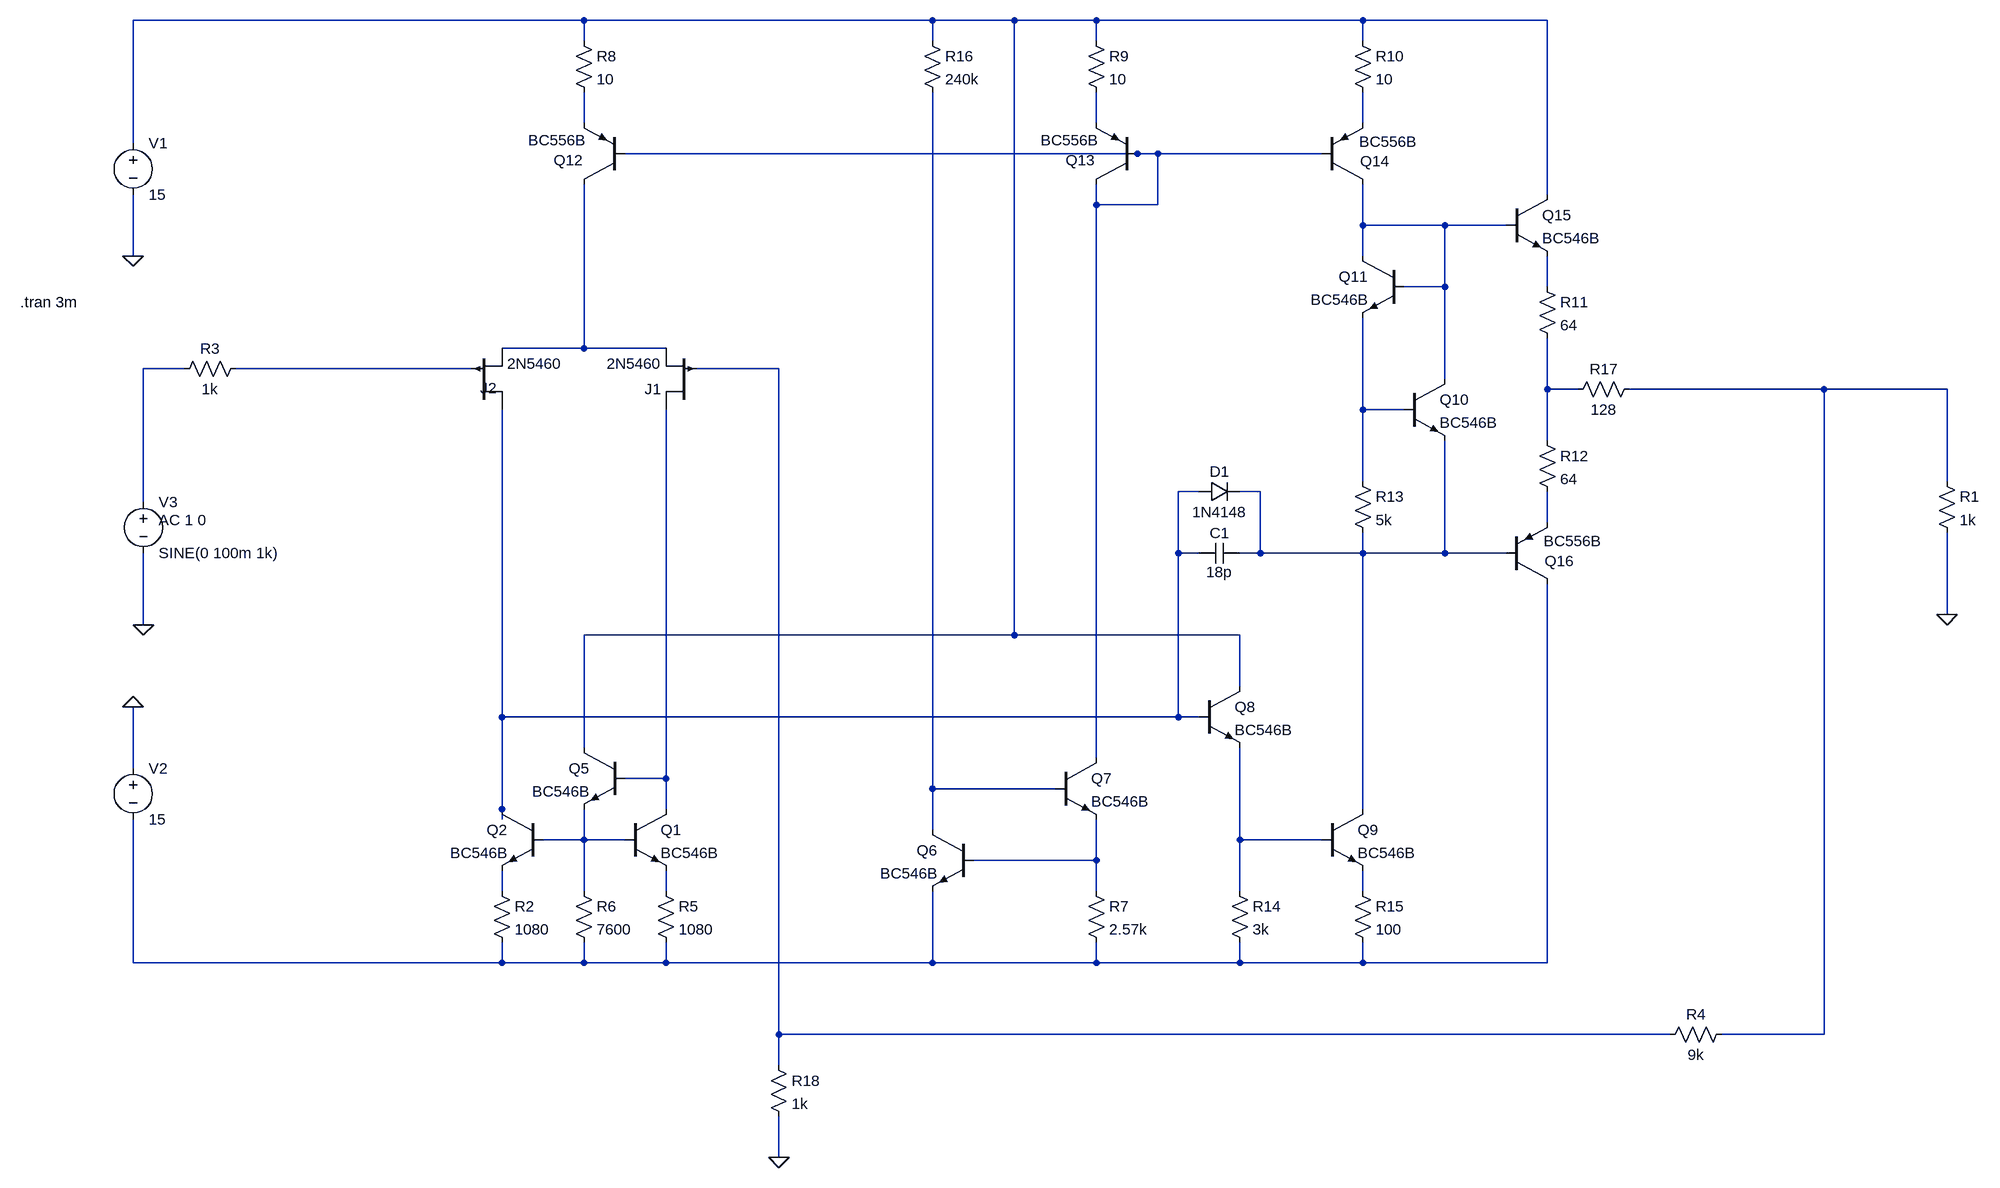
[diagram p0: schematic TL071 discrete test alone.asc]
TL071 discrete test alone.asc, the LTspice schematic file:
Version 4
SHEET 1 880 680
WIRE -9392 -4048 -10096 -4048
WIRE -8848 -4048 -9392 -4048
WIRE -8720 -4048 -8848 -4048
WIRE -8592 -4048 -8720 -4048
WIRE -8176 -4048 -8592 -4048
WIRE -7888 -4048 -8176 -4048
WIRE -9392 -4016 -9392 -4048
WIRE -8848 -4016 -8848 -4048
WIRE -8592 -4016 -8592 -4048
WIRE -8176 -4016 -8176 -4048
WIRE -9392 -3888 -9392 -3936
WIRE -8592 -3888 -8592 -3936
WIRE -8176 -3888 -8176 -3936
WIRE -10096 -3856 -10096 -4048
WIRE -8528 -3840 -9328 -3840
WIRE -8496 -3840 -8528 -3840
WIRE -8240 -3840 -8496 -3840
WIRE -7888 -3776 -7888 -4048
WIRE -8592 -3760 -8592 -3792
WIRE -8496 -3760 -8496 -3840
WIRE -8496 -3760 -8592 -3760
WIRE -8176 -3728 -8176 -3792
WIRE -8048 -3728 -8176 -3728
WIRE -7952 -3728 -8048 -3728
WIRE -10096 -3680 -10096 -3776
WIRE -8176 -3680 -8176 -3728
WIRE -8048 -3632 -8048 -3728
WIRE -8048 -3632 -8112 -3632
WIRE -7888 -3632 -7888 -3680
WIRE -9392 -3536 -9392 -3792
WIRE -9392 -3536 -9520 -3536
WIRE -9264 -3536 -9392 -3536
WIRE -10016 -3504 -10080 -3504
WIRE -9568 -3504 -9936 -3504
WIRE -9088 -3504 -9216 -3504
WIRE -8048 -3488 -8048 -3632
WIRE -7888 -3472 -7888 -3552
WIRE -7840 -3472 -7888 -3472
WIRE -7456 -3472 -7760 -3472
WIRE -7264 -3472 -7456 -3472
WIRE -8176 -3440 -8176 -3584
WIRE -8112 -3440 -8176 -3440
WIRE -7888 -3392 -7888 -3472
WIRE -8176 -3328 -8176 -3440
WIRE -7264 -3328 -7264 -3472
WIRE -8432 -3312 -8464 -3312
WIRE -8336 -3312 -8368 -3312
WIRE -10080 -3296 -10080 -3504
WIRE -7888 -3264 -7888 -3312
WIRE -8464 -3216 -8464 -3312
WIRE -8432 -3216 -8464 -3216
WIRE -8336 -3216 -8336 -3312
WIRE -8336 -3216 -8368 -3216
WIRE -8176 -3216 -8176 -3248
WIRE -8176 -3216 -8336 -3216
WIRE -8048 -3216 -8048 -3392
WIRE -8048 -3216 -8176 -3216
WIRE -7952 -3216 -8048 -3216
WIRE -7264 -3120 -7264 -3248
WIRE -10080 -3104 -10080 -3216
WIRE -8720 -3088 -8720 -4048
WIRE -8720 -3088 -9392 -3088
WIRE -8368 -3088 -8720 -3088
WIRE -8368 -3008 -8368 -3088
WIRE -9520 -2960 -9520 -3440
WIRE -8464 -2960 -8464 -3216
WIRE -8464 -2960 -9520 -2960
WIRE -8432 -2960 -8464 -2960
WIRE -9392 -2912 -9392 -3088
WIRE -8592 -2896 -8592 -3760
WIRE -10096 -2880 -10096 -2976
WIRE -9264 -2864 -9264 -3440
WIRE -9264 -2864 -9328 -2864
WIRE -8848 -2848 -8848 -3936
WIRE -8656 -2848 -8848 -2848
WIRE -9520 -2816 -9520 -2960
WIRE -9264 -2816 -9264 -2864
WIRE -8176 -2816 -8176 -3216
WIRE -9520 -2800 -9520 -2816
WIRE -8848 -2784 -8848 -2848
WIRE -9392 -2768 -9392 -2816
WIRE -9392 -2768 -9456 -2768
WIRE -9328 -2768 -9392 -2768
WIRE -8368 -2768 -8368 -2912
WIRE -8240 -2768 -8368 -2768
WIRE -8592 -2736 -8592 -2800
WIRE -8592 -2736 -8784 -2736
WIRE -9520 -2688 -9520 -2720
WIRE -9392 -2688 -9392 -2768
WIRE -9264 -2688 -9264 -2720
WIRE -8592 -2688 -8592 -2736
WIRE -8368 -2688 -8368 -2768
WIRE -8176 -2688 -8176 -2720
WIRE -10096 -2576 -10096 -2800
WIRE -9520 -2576 -9520 -2608
WIRE -9520 -2576 -10096 -2576
WIRE -9392 -2576 -9392 -2608
WIRE -9392 -2576 -9520 -2576
WIRE -9264 -2576 -9264 -2608
WIRE -9264 -2576 -9392 -2576
WIRE -8848 -2576 -8848 -2688
WIRE -8848 -2576 -9264 -2576
WIRE -8592 -2576 -8592 -2608
WIRE -8592 -2576 -8848 -2576
WIRE -8368 -2576 -8368 -2608
WIRE -8368 -2576 -8592 -2576
WIRE -8176 -2576 -8176 -2608
WIRE -8176 -2576 -8368 -2576
WIRE -7888 -2576 -7888 -3168
WIRE -7888 -2576 -8176 -2576
WIRE -9088 -2464 -9088 -3504
WIRE -7696 -2464 -9088 -2464
WIRE -7456 -2464 -7456 -3472
WIRE -7456 -2464 -7616 -2464
WIRE -9088 -2416 -9088 -2464
WIRE -9088 -2272 -9088 -2336
FLAG -10096 -3680 0
FLAG -10096 -2976 0
FLAG -10080 -3104 0
FLAG -7264 -3120 0
FLAG -9088 -2272 0
SYMBOL cap -8368 -3232 R90
WINDOW 0 0 32 VBottom 0
WINDOW 3 30 32 VTop 0
SYMATTR InstName C1
SYMATTR Value 18p
SYMBOL npn -9328 -2816 R0
SYMATTR InstName Q1
SYMATTR Value BC546B
SYMBOL npn -9456 -2816 M0
SYMATTR InstName Q2
SYMATTR Value BC546B
SYMBOL diode -8432 -3296 R270
WINDOW 0 32 32 VTop 0
WINDOW 3 0 32 VBottom 0
SYMATTR InstName D1
SYMATTR Value 1N4148
SYMBOL pjf -9216 -3440 R180
SYMATTR InstName J1
SYMATTR Value 2N5460
SYMBOL pjf -9568 -3440 M180
WINDOW 0 14 34 Left 0
SYMATTR InstName J2
SYMATTR Value 2N5460
SYMBOL npn -9328 -2912 M0
SYMATTR InstName Q5
SYMATTR Value BC546B
SYMBOL npn -8784 -2784 M0
SYMATTR InstName Q6
SYMATTR Value BC546B
SYMBOL npn -8656 -2896 R0
SYMATTR InstName Q7
SYMATTR Value BC546B
SYMBOL npn -8432 -3008 R0
SYMATTR InstName Q8
SYMATTR Value BC546B
SYMBOL npn -8240 -2816 R0
SYMATTR InstName Q9
SYMATTR Value BC546B
SYMBOL npn -8112 -3488 R0
SYMATTR InstName Q10
SYMATTR Value BC546B
SYMBOL npn -8112 -3680 M0
SYMATTR InstName Q11
SYMATTR Value BC546B
SYMBOL pnp -9328 -3792 R180
WINDOW 0 66 38 Left 0
WINDOW 3 62 69 Left 0
SYMATTR InstName Q12
SYMATTR Value BC556B
SYMBOL pnp -8528 -3792 R180
WINDOW 0 66 38 Left 0
WINDOW 3 62 69 Left 0
SYMATTR InstName Q13
SYMATTR Value BC556B
SYMBOL pnp -8240 -3792 M180
WINDOW 0 60 36 Left 0
WINDOW 3 58 67 Left 0
SYMATTR InstName Q14
SYMATTR Value BC556B
SYMBOL npn -7952 -3776 R0
SYMATTR InstName Q15
SYMATTR Value BC546B
SYMBOL pnp -7952 -3168 M180
WINDOW 0 60 36 Left 0
WINDOW 3 58 67 Left 0
SYMATTR InstName Q16
SYMATTR Value BC556B
SYMBOL res -9536 -2704 R0
SYMATTR InstName R2
SYMATTR Value 1080
SYMBOL res -9280 -2704 R0
SYMATTR InstName R5
SYMATTR Value 1080
SYMBOL res -9408 -2704 R0
SYMATTR InstName R6
SYMATTR Value 7600
SYMBOL res -8608 -2704 R0
SYMATTR InstName R7
SYMATTR Value 2.57k
SYMBOL res -9408 -4032 R0
SYMATTR InstName R8
SYMATTR Value 10
SYMBOL res -8608 -4032 R0
SYMATTR InstName R9
SYMATTR Value 10
SYMBOL res -8192 -4032 R0
SYMATTR InstName R10
SYMATTR Value 10
SYMBOL res -7904 -3648 R0
SYMATTR InstName R11
SYMATTR Value 64
SYMBOL res -7904 -3408 R0
SYMATTR InstName R12
SYMATTR Value 64
SYMBOL res -8192 -3344 R0
SYMATTR InstName R13
SYMATTR Value 5k
SYMBOL res -8384 -2704 R0
SYMATTR InstName R14
SYMATTR Value 3k
SYMBOL res -8192 -2704 R0
SYMATTR InstName R15
SYMATTR Value 100
SYMBOL res -8864 -4032 R0
SYMATTR InstName R16
SYMATTR Value 240k
SYMBOL res -7744 -3488 R90
WINDOW 0 0 56 VBottom 0
WINDOW 3 32 56 VTop 0
SYMATTR InstName R17
SYMATTR Value 128
SYMBOL voltage -10096 -3872 R0
WINDOW 123 0 0 Left 0
WINDOW 39 0 0 Left 0
SYMATTR InstName V1
SYMATTR Value 15
SYMBOL voltage -10096 -2896 R0
WINDOW 123 0 0 Left 0
WINDOW 39 0 0 Left 0
SYMATTR InstName V2
SYMATTR Value 15
SYMBOL voltage -10080 -3312 R0
WINDOW 123 24 44 Left 0
WINDOW 39 0 0 Left 0
SYMATTR Value2 AC 1 0
SYMATTR InstName V3
SYMATTR Value SINE(0 100m 1k)
SYMBOL res -7280 -3344 R0
SYMATTR InstName R1
SYMATTR Value 1k
SYMBOL res -9920 -3520 R90
WINDOW 0 0 56 VBottom 0
WINDOW 3 32 56 VTop 0
SYMATTR InstName R3
SYMATTR Value 1k
SYMBOL res -7600 -2480 R90
WINDOW 0 0 56 VBottom 0
WINDOW 3 32 56 VTop 0
SYMATTR InstName R4
SYMATTR Value 9k
SYMBOL res -9104 -2432 R0
SYMATTR InstName R18
SYMATTR Value 1k
TEXT -10272 -3608 Left 0 !.tran 3m

The netlist it stands for:
* TL071 discrete test alone.asc
C1 N016 N015 18p
Q1 N018 N020 N024 0 BC546B
Q2 N015 N020 N023 0 BC546B
D1 N015 N016 1N4148
J1 N018 N011 N008 2N5460
J2 N015 N010 N008 2N5460
Q5 N001 N018 N020 0 BC546B
Q6 N019 N022 N026 0 BC546B
Q7 N005 N019 N022 0 BC546B
Q8 N001 N015 N021 0 BC546B
Q9 N016 N021 N025 0 BC546B
Q10 N006 N014 N016 0 BC546B
Q11 N006 N006 N014 0 BC546B
Q12 N008 N005 N002 0 BC556B
Q13 N005 N005 N003 0 BC556B
Q14 N006 N005 N004 0 BC556B
Q15 N001 N006 N007 0 BC546B
Q16 N026 N016 N017 0 BC556B
R2 N023 N026 1080
R5 N024 N026 1080
R6 N020 N026 7600
R7 N022 N026 2.57k
R8 N001 N002 10
R9 N001 N003 10
R10 N001 N004 10
R11 N007 N012 64
R12 N012 N017 64
R13 N014 N016 5k
R14 N021 N026 3k
R15 N025 N026 100
R16 N001 N019 240k
R17 N013 N012 128
V1 N001 0 15
V2 0 N026 15
V3 N009 0 SINE(0 100m 1k) AC 1 0
R1 N013 0 1k
R3 N010 N009 1k
R4 N013 N011 9k
R18 N011 0 1k
.model D D
.lib standard.dio
.model NPN NPN
.model PNP PNP
.lib standard.bjt
.model NJF NJF
.model PJF PJF
.lib standard.jft
.tran 3m
.backanno
.end